# EAGLE schematic EDCPSUMK2 (EAGLE 9.6.2)
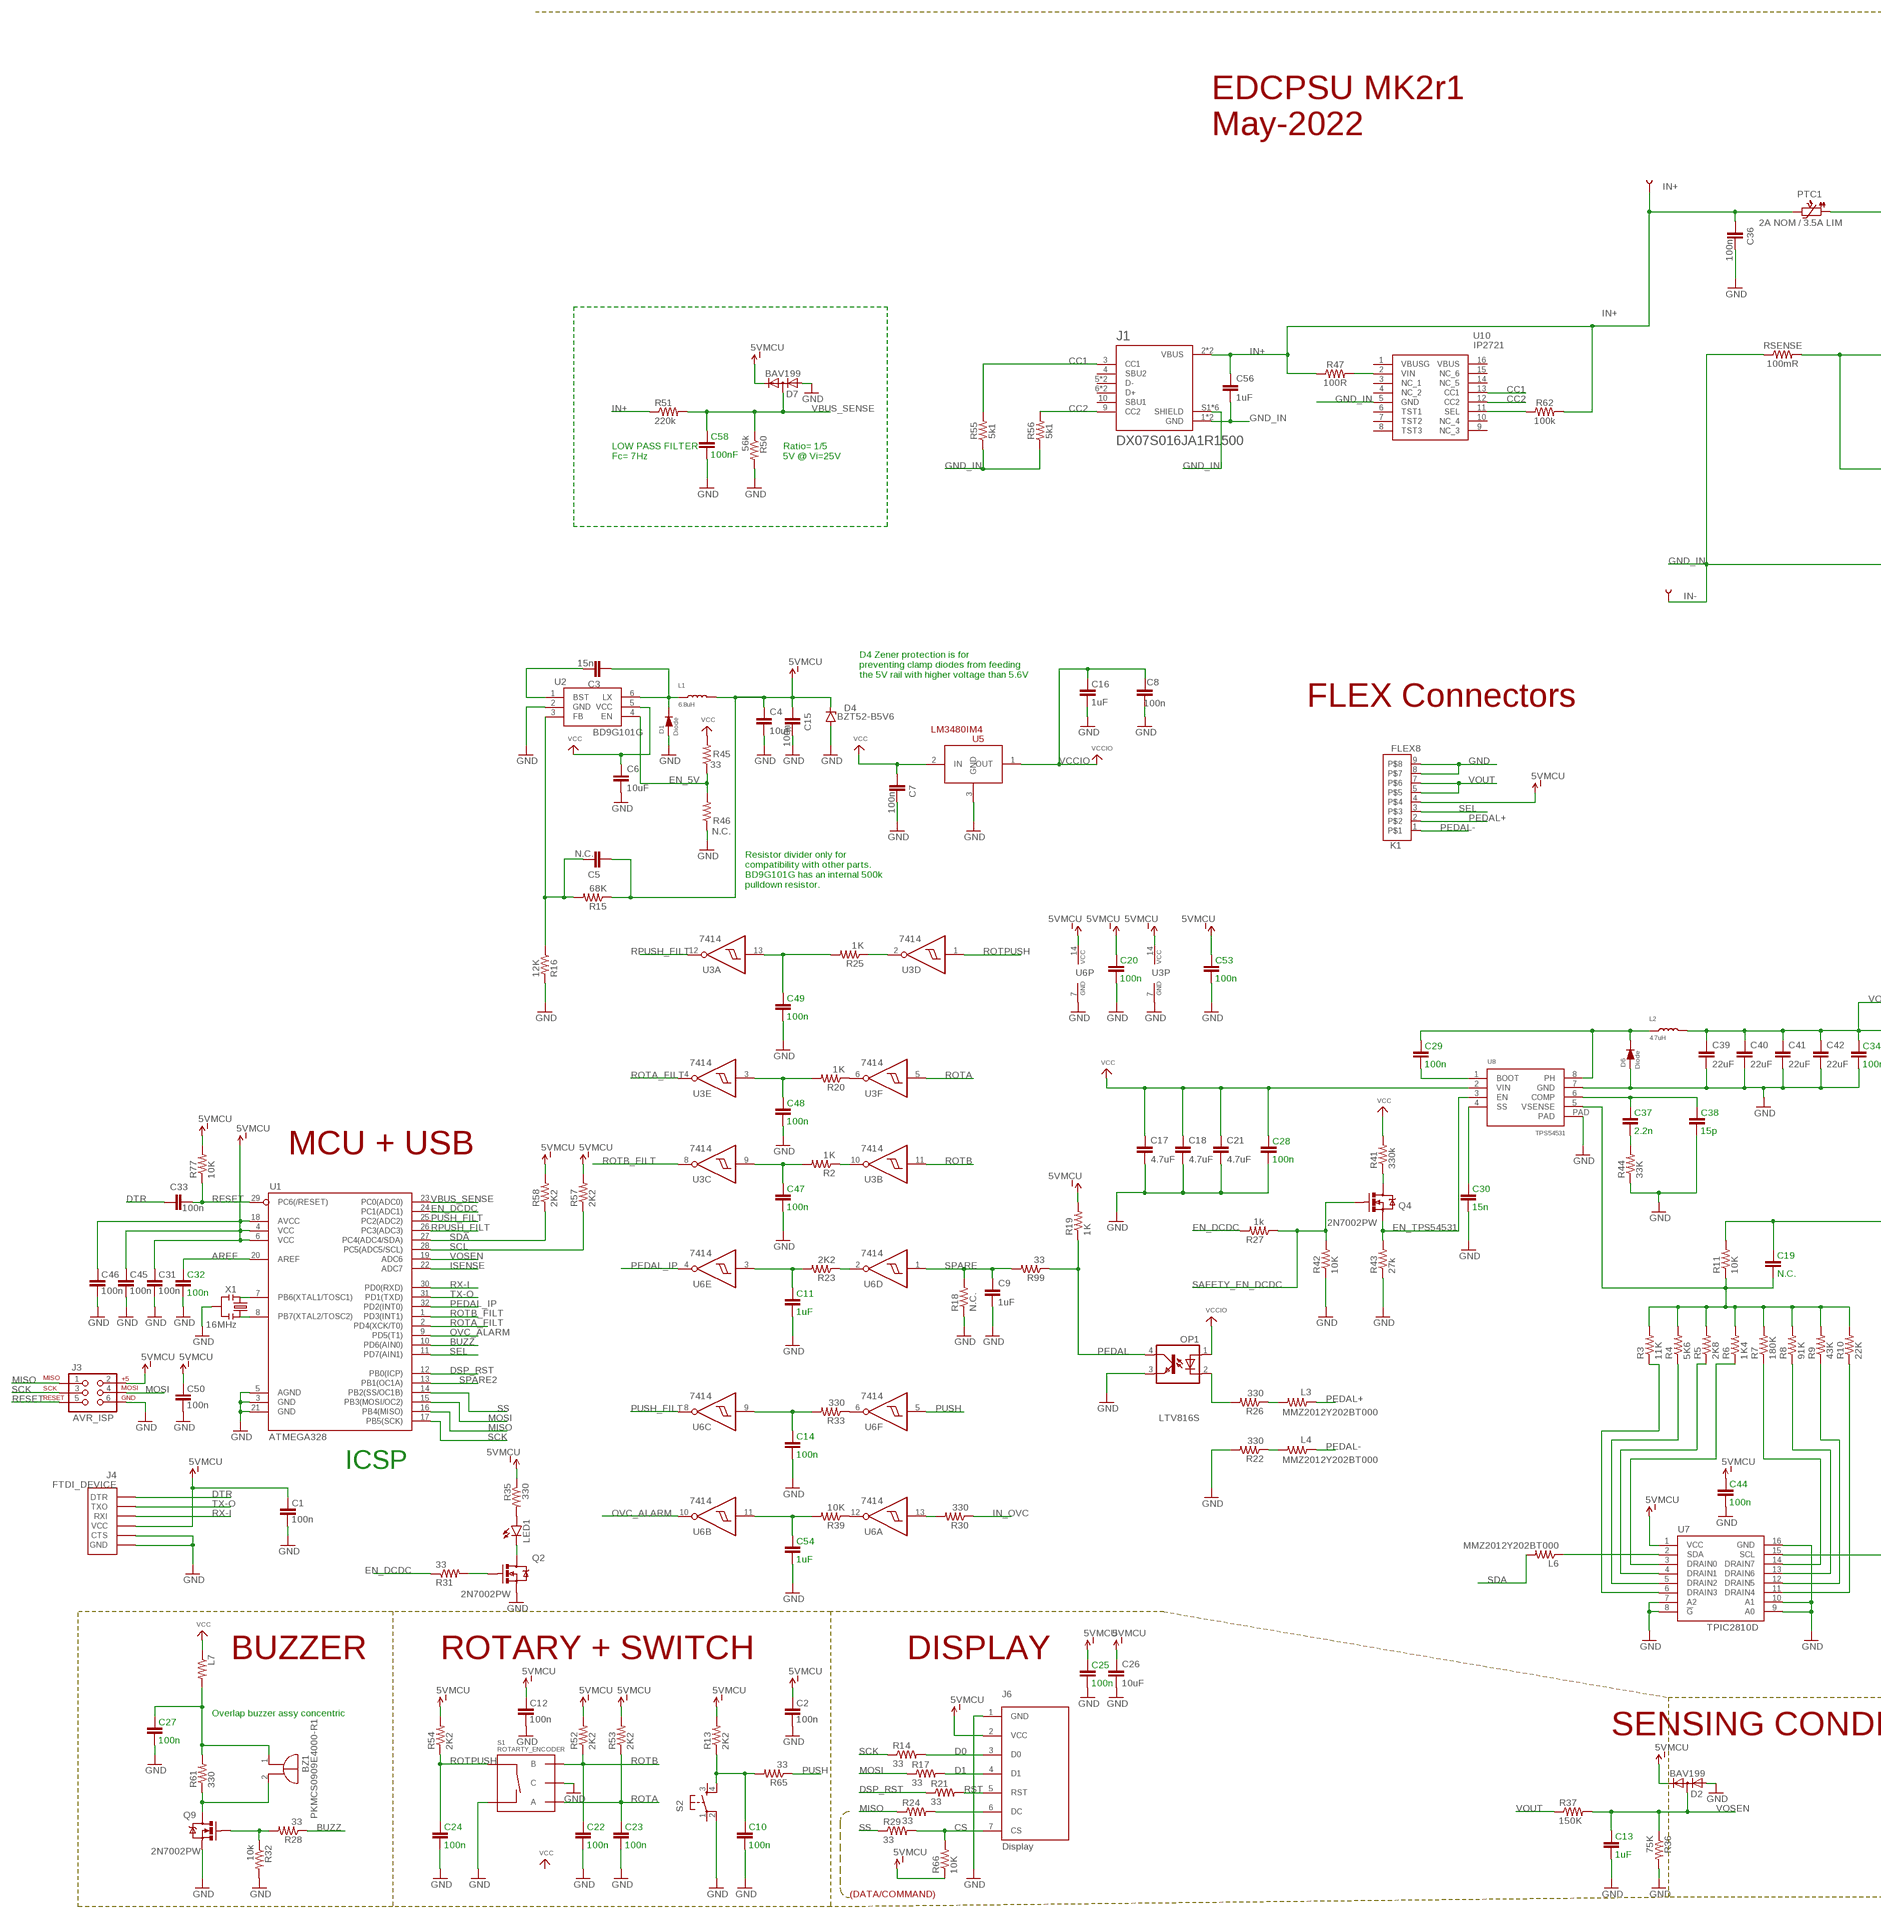
[diagram p0: schematic, sheet 1, part 1 of 2]
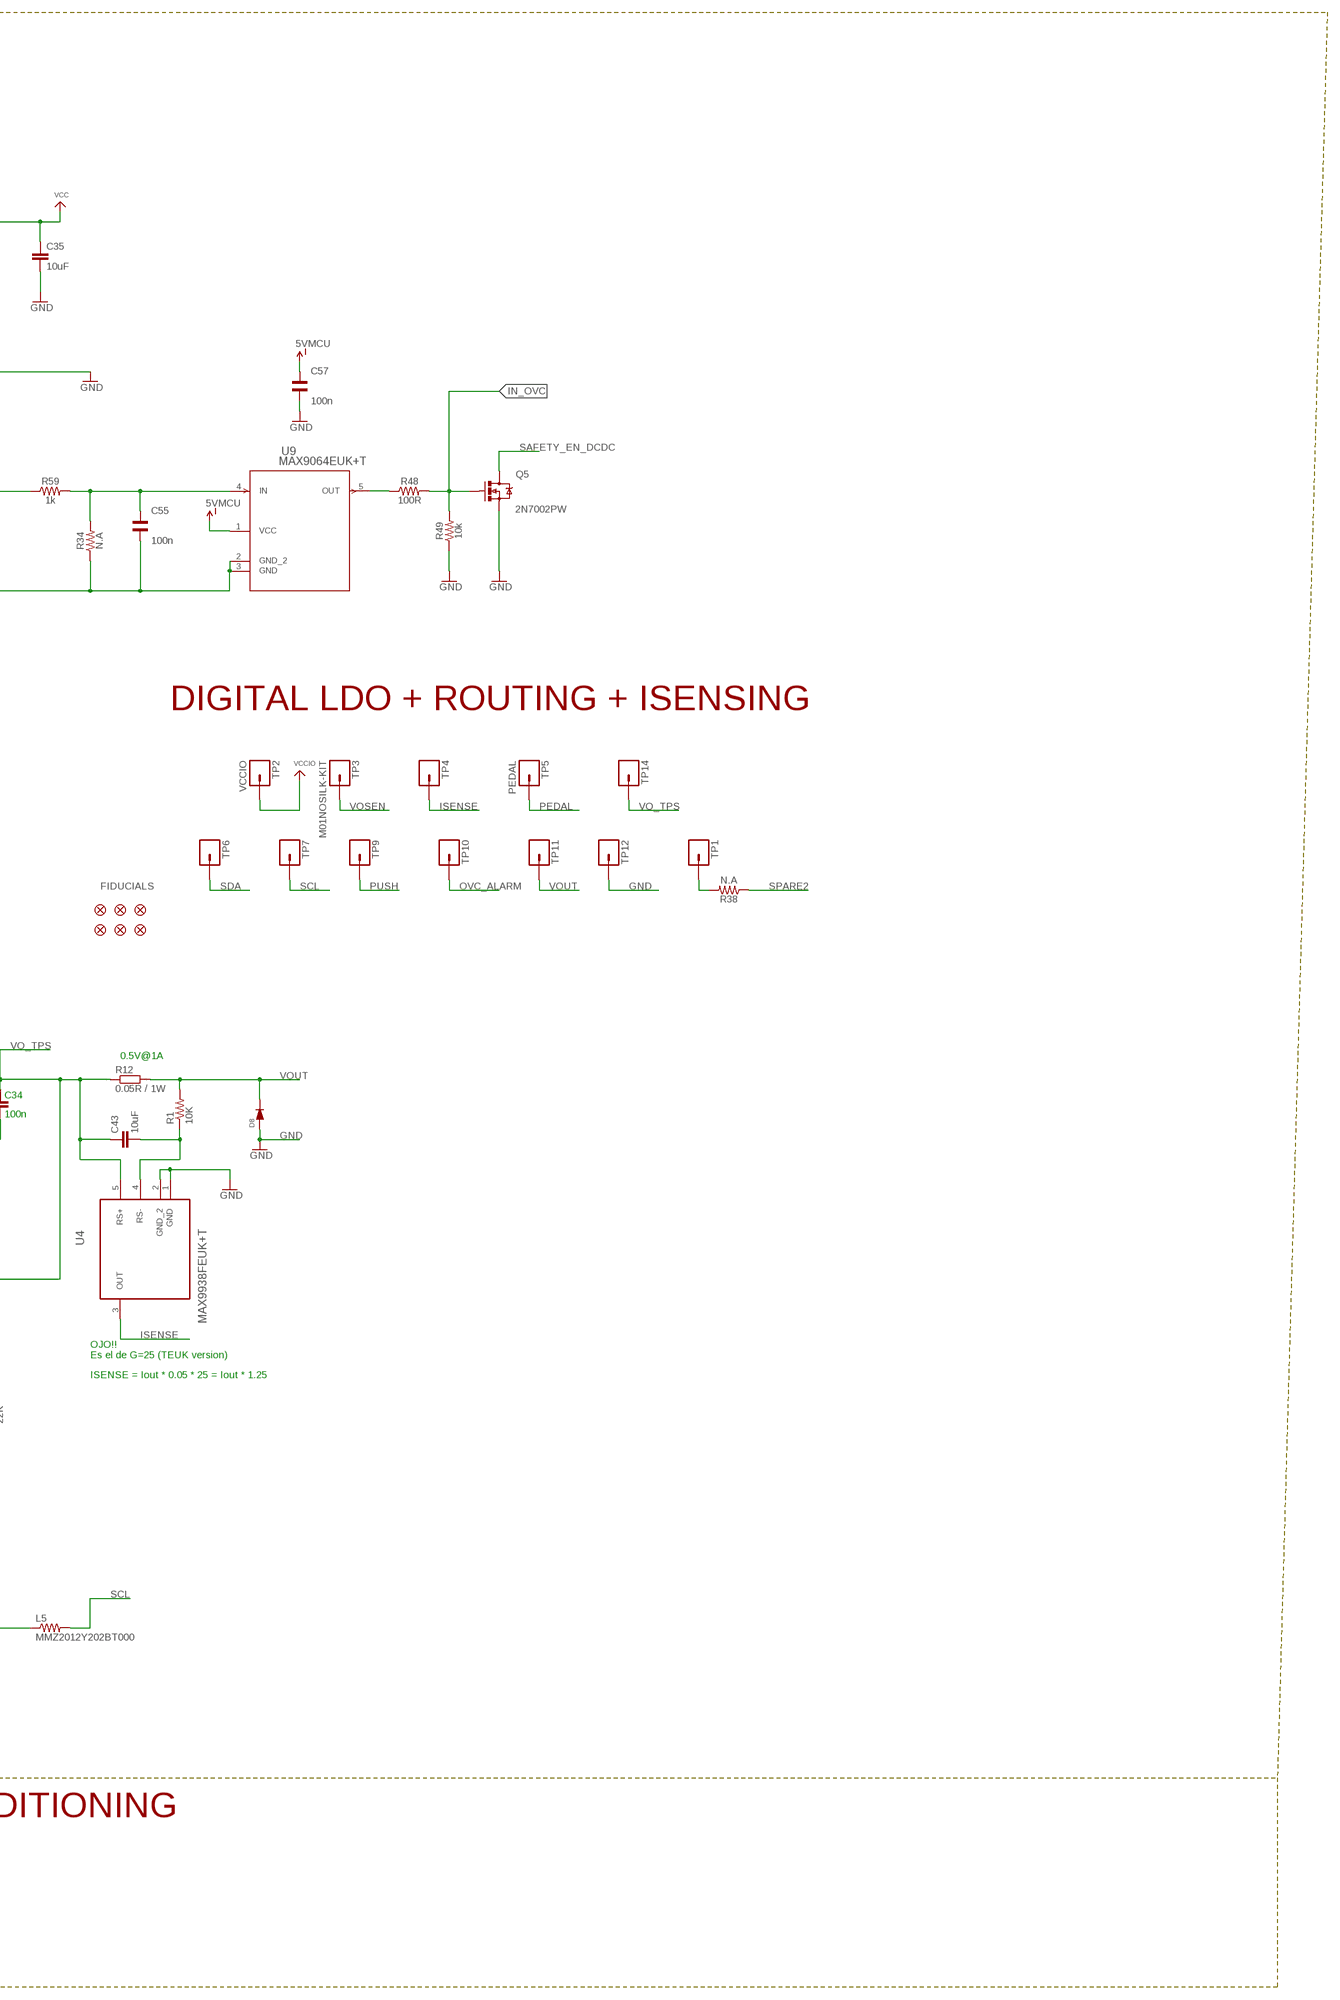
[diagram p1: schematic, sheet 1, part 2 of 2]

## Parts
BZ1  PKMCS0909E4000-R1  [PKMCS0909]
C1  100n  CAP0805  [0805]
C2  100n  CAP0805  [0805]
C3  15n  CAP0805  [0805]
C4  10uF  CAP1206  [1206]
C5  N.C.  CAP0805  [0805]
C6  10uF  CAP1206  [1206]
C7  100n  CAP0805  [0805]
C8  100n  CAP0805  [0805]
C9  1uF  CAP1206  [1206]
C10  100n  CAP0805  [0805]
C11  1uF  CAP0805  [0805]
C12  100n  CAP0805  [0805]
C13  1uF  CAP0805  [0805]
C14  100n  CAP0805  [0805]
C15  100n  CAP0805  [0805]
C16  1uF  CAP0805  [0805]
C17  4.7uF  CAP1210  [1210]
C18  4.7uF  CAP1210  [1210]
C19  N.C.  CAP0805  [0805]
C20  100n  CAP0805  [0805]
C21  4.7uF  CAP1210  [1210]
C22  100n  CAP0805  [0805]
C23  100n  CAP0805  [0805]
C24  100n  CAP0805  [0805]
C25  100n  CAP0805  [0805]
C26  10uF  CAP1206  [1206]
C27  100n  CAP0805  [0805]
C28  100n  CAP0805  [0805]
C29  100n  CAP0805  [0805]
C30  15n  CAP0805  [0805]
C31  100n  CAP0805  [0805]
C32  100n  CAP0805  [0805]
C33  100n  CAP0805  [0805]
C34  100n  CAP0805  [0805]
C35  10uF  CAP1206  [1206]
C36  100n  CAP0805  [0805]
C37  2.2n  CAP0805  [0805]
C38  15p  CAP0805  [0805]
C39  22uF  CAP1210  [1210]
C40  22uF  CAP1210  [1210]
C41  22uF  CAP1210  [1210]
C42  22uF  CAP1210  [1210]
C43  10uF  CAP1206  [1206]
C44  100n  CAP0805  [0805]
C45  100n  CAP0805  [0805]
C46  100n  CAP0805  [0805]
C47  100n  CAP0805  [0805]
C48  100n  CAP0805  [0805]
C49  100n  CAP0805  [0805]
C50  100n  CAP0805  [0805]
C53  100n  CAP0805  [0805]
C54  1uF  CAP0805  [0805]
C55  100n  WCAP-CSGP_1206_885012008001  [WCAP-CSGP_1206]
C56  1uF  CAP1206  [1206]
C57  100n  WCAP-CSGP_1206_885012008001  [WCAP-CSGP_1206]
C58  100nF  CAP0805  [0805]
D1  Diode  DSOD123  [SOD123]
D2  BAV199  [SOT23]
D4  BZT52-B5V6  ZENER_DO-219-AB(SOD123F)  [SODFL3718X115]
D6  Diode  DSMC  [DO-214AB]
D7  BAV199  [SOT23]
D8  RB060M-60TR  DSMA  [SMADIODE]
FID1  FIDUCIAL1X2  [FIDUCIAL-1X2]
FID2  FIDUCIAL1X2  [FIDUCIAL-1X2]
FID3  FIDUCIAL1X2  [FIDUCIAL-1X2]
FID4  FIDUCIAL1X2  [FIDUCIAL-1X2]
FID5  FIDUCIAL1X2  [FIDUCIAL-1X2]
FID6  FIDUCIAL1X2  [FIDUCIAL-1X2]
IN+  TEST-POINT3  [PAD.03X.03]
IN-  TEST-POINT3  [PAD.03X.03]
J1  DX07S016JA1R1500  [JAE_DX07S016JA1R1500]
J3  AVR_ISP  AVR_SPI_PRG_6PTH  [2X3]
J4  FTDI_DEVICE  [FTDI_DEVICE_SIDE]
J6  Display  OLED_LCD  [OLED_LCD]
K1  FLEX8  [FLEX8]
L1  6.8uH  L4018  [NR4018T100M]
L2  4.7uH  L74437368047  [WE-LHMI]
L3  MMZ2012Y202BT000  RESISTOR0805-RES  [0805]
L4  MMZ2012Y202BT000  RESISTOR0805-RES  [0805]
L5  MMZ2012Y202BT000  RESISTOR0805-RES  [0805]
L6  MMZ2012Y202BT000  RESISTOR0805-RES  [0805]
L7  MMZ2012Y202BT000  RESISTOR0805-RES  [0805]
LED1  LED3MM  [LED3MM]
OP1  LTV816S  [SMD4]
PTC1  2A NOM / 3.5A LIM  PTC-  [1812L]
Q2  2N7002PW  MOSFET-NCHANNEL2N7002PW  [SOT323]
Q4  2N7002PW  MOSFET-NCHANNEL2N7002PW  [SOT323]
Q5  2N7002PW  MOSFET-NCHANNEL2N7002PW  [SOT323]
Q9  2N7002PW  MOSFET-NCHANNEL2N7002PW  [SOT323]
R1  10K  RESISTOR0805-RES  [0805]
R2  1K  RESISTOR0805-RES  [0805]
R3  11K  RESISTOR0805-RES  [0805]
R4  5K6  RESISTOR0805-RES  [0805]
R5  2K8  RESISTOR0805-RES  [0805]
R6  1K4  RESISTOR0805-RES  [0805]
R7  180K  RESISTOR0805-RES  [0805]
R8  91K  RESISTOR0805-RES  [0805]
R9  43K  RESISTOR0805-RES  [0805]
R10  22K  RESISTOR0805-RES  [0805]
R11  10K  RESISTOR0805-RES  [0805]
R12  0.05R / 1W  RR2512  [R2512]
R13  2K2  RESISTOR0805-RES  [0805]
R14  33  RESISTOR0805-RES  [0805]
R15  68K  RESISTOR0805-RES  [0805]
R16  12K  RESISTOR0805-RES  [0805]
R17  33  RESISTOR0805-RES  [0805]
R18  N.C.  RESISTOR0805-RES  [0805]
R19  1K  RESISTOR0805-RES  [0805]
R20  1K  RESISTOR0805-RES  [0805]
R21  33  RESISTOR0805-RES  [0805]
R22  330  RESISTOR1206  [1206]
R23  2K2  RESISTOR0805-RES  [0805]
R24  33  RESISTOR0805-RES  [0805]
R25  1K  RESISTOR0805-RES  [0805]
R26  330  RESISTOR1206  [1206]
R27  1k  RESISTOR0805-RES  [0805]
R28  33  RESISTOR0805-RES  [0805]
R29  33  RESISTOR0805-RES  [0805]
R30  330  RESISTOR0805-RES  [0805]
R31  33  RESISTOR0805-RES  [0805]
R32  10k  RESISTOR0805-RES  [0805]
R33  330  RESISTOR0805-RES  [0805]
R34  N.A  RESISTOR0603  [0603]
R35  330  RESISTOR0805-RES  [0805]
R36  75K  RESISTOR0805-RES  [0805]
R37  150K  RESISTOR0805-RES  [0805]
R38  N.A  RESISTOR0603  [0603]
R39  10K  RESISTOR0805-RES  [0805]
R41  330k  RESISTOR0805-RES  [0805]
R42  10K  RESISTOR0805-RES  [0805]
R43  27k  RESISTOR0805-RES  [0805]
R44  33K  RESISTOR0805-RES  [0805]
R45  33  RESISTOR0805-RES  [0805]
R46  N.C.  RESISTOR0805-RES  [0805]
R47  100R  RESISTOR0603  [0603]
R48  100R  RESISTOR0603  [0603]
R49  10k  RESISTOR0603  [0603]
R50  56k  RESISTOR0603  [0603]
R51  220k  RESISTOR0603  [0603]
R52  2K2  RESISTOR0805-RES  [0805]
R53  2K2  RESISTOR0805-RES  [0805]
R54  2K2  RESISTOR0805-RES  [0805]
R55  5k1  RESISTOR0603  [0603]
R56  5k1  RESISTOR0603  [0603]
R57  2K2  RESISTOR0805-RES  [0805]
R58  2K2  RESISTOR0805-RES  [0805]
R59  1k  RESISTOR0603  [0603]
R61  330  RESISTOR0805-RES  [0805]
R62  100k  RESISTOR0603  [0603]
R65  33  RESISTOR0805-RES  [0805]
R66  10K  RESISTOR0805-RES  [0805]
R77  10K  RESISTOR0805-RES  [0805]
R99  33  RESISTOR0805-RES  [0805]
RSENSE  100mR  RESISTOR1206  [1206]
S1  ROTARTY_ENCODER  [ROTARY_ENC_PLAIN]
S2  TAC_SWITCH_KSC931G-SMD  [TAC_SW_SMD_KSC931G]
TP1  M01POGOPIN_HOLE_LARGE  [1X01_POGOPIN_HOLE_LARGE]
TP2  VCCIO  M01POGOPIN_HOLE_LARGE  [1X01_POGOPIN_HOLE_LARGE]
TP3  M01NOSILK-KIT  [1X01NS-KIT]
TP4  M01POGOPIN_HOLE_LARGE  [1X01_POGOPIN_HOLE_LARGE]
TP5  PEDAL  M01POGOPIN_HOLE_LARGE  [1X01_POGOPIN_HOLE_LARGE]
TP6  M01POGOPIN_HOLE_LARGE  [1X01_POGOPIN_HOLE_LARGE]
TP7  M01POGOPIN_HOLE_LARGE  [1X01_POGOPIN_HOLE_LARGE]
TP9  M01POGOPIN_HOLE_LARGE  [1X01_POGOPIN_HOLE_LARGE]
TP10  M01POGOPIN_HOLE_LARGE  [1X01_POGOPIN_HOLE_LARGE]
TP11  M01POGOPIN_HOLE_LARGE  [1X01_POGOPIN_HOLE_LARGE]
TP12  M01POGOPIN_HOLE_LARGE  [1X01_POGOPIN_HOLE_LARGE]
TP14  M01POGOPIN_HOLE_LARGE  [1X01_POGOPIN_HOLE_LARGE]
U1  ATMEGA328  ATMEGA168  [TQFP32-08]
U2  BD9G101G  [SSOP6]
U3  7414  [TSSOP14]
U4  MAX9938FEUK+T  [SOT95P280X145-5N]
U5  LM3480IM4  [SOT23-3]
U6  7414  [TSSOP14]
U7  TPIC2810D  [SO16]
U8  TPS54531  TPS5431DDAR  [SOIC8]
U9  MAX9064EUK+T  [21-0057F_MXM]
U10  IP2721  [SOP65P640X120-16N]
X1  16MHz  RESONATORSMD  [RESONATOR-SMD]

## Nets
AREF: C32.2 U1.20(AREF)
BUZZ: R28.1 U1.10(PD6(AIN0))
CC1: J1.3(CC1) R55.2 U10.13(CC1)
CC2: J1.9(CC2) R56.2 U10.12(CC2)
CS: J6.7(CS) R29.2 R66.2
D0: J6.3(D0) R14.2
D1: J6.4(D1) R17.2
DSP_RST: R21.1 U1.12(PB0(ICP))
DTR: C33.2 J4.P$1(DTR)
EN_5V: R45.1 R46.2 U2.4(EN)
EN_DCDC: R27.2 R31.1 U1.24(PC1(ADC1))
EN_TPS54531: Q4.2(S) R43.2 U8.3(EN)
GND: C1.1 C2.1 C4.2 C6.2 C7.1 C8.1 C9.2 C10.1 C11.1 C12.1 C13.1 C14.1 C15.1 C16.1 C17.2 C18.2 C20.1 C21.2 C22.1 C23.1 C24.1 C25.1 C26.2 C27.1 C28.1 C30.1 C31.1 C32.1 C34.1 C35.2 C36.1 C38.1 C39.2 C40.2 C41.2 C42.2 C44.1 C45.1 C46.1 C47.1 C48.1 C49.1 C50.1 C53.1 C54.1 C57.1 C58.1 D1.+(A) D2.1(A) D4.1(A) D6.1(A) D7.1(A) D8.A J3.6 J4.P$5(CTS) J4.P$6(GND) J6.1(GND) K1.8 K1.9 OP1.3(EMIT) Q2.2(S) Q5.2(S) Q9.2(S) R16.2 R18.1 R22.2 R32.2 R36.2 R42.1 R43.1 R44.1 R46.1 R49.1 R50.2 R59.1 RSENSE.2 S1.C S1.SW- S2.2 TP12.1 U1.3(GND) U1.5(AGND) U1.21(GND) U2.2(GND) U3.7(P:GND) U4.1(GND) U4.2(GND_2) U5.3(GND) U6.7(P:GND) U7.7(A2) U7.8(!G) U7.9(A0) U7.10(A1) U7.16(GND) U8.7(GND) U8.PAD X1.2
GND_IN: C55.1 C56.2 IN-.P$1 J1.1(GND) J1.12(GND) J1.S1(SHIELD) J1.S2(SHIELD) J1.S3(SHIELD) J1.S4(SHIELD) J1.S5(SHIELD) J1.S6(SHIELD) R34.1 R55.1 R56.1 RSENSE.1 U9.2(GND_2) U9.3(GND) U10.5(GND)
IN+: C36.2 C56.1 IN+.P$1 J1.2(VBUS) J1.11(VBUS) PTC1.2 R47.1 R51.1 R62.2
IN_OVC: Q5.1(G) R30.1 R48.2 R49.2
ISENSE: TP4.1 U1.22(ADC7) U4.3(OUT)
MISO: J3.1 R24.1 U1.16(PB4(MISO))
MOSI: J3.4 R17.1 U1.15(PB3(MOSI/OC2))
N$1: R3.1 U7.6(DRAIN3)
N$2: R4.1 U7.5(DRAIN2)
N$3: R5.1 U7.4(DRAIN1)
N$4: R6.1 U7.3(DRAIN0)
N$5: R7.1 U7.14(DRAIN7)
N$6: J6.6(DC) R24.2
N$7: R8.1 U7.13(DRAIN6)
N$8: R9.1 U7.12(DRAIN5)
N$9: R10.1 U7.11(DRAIN4)
N$10: C43.2 R1.1 U4.4(RS-)
N$11: LED1.A R35.2
N$12: LED1.K(C) Q2.3(D)
N$13: R33.1 U6.6(F:O)
N$14: R30.2 U6.13(A:I)
N$15: R39.1 U6.12(A:O)
N$16: C3.1 U2.1(BST)
N$17: C10.2 R13.1 R65.2 S2.4
N$18: C47.2 R2.2 U3.9(C:I)
N$19: C3.2 D1.-(K) L1.1 U2.6(LX)
N$20: Q9.1(G) R28.2 R32.1
N$21: Q2.1(G) R31.2
N$22: R2.1 U3.10(B:O)
N$23: R20.1 U3.6(F:O)
N$24: U1.8(PB7(XTAL2/TOSC2)) X1.1
N$25: R25.1 U3.2(D:O)
N$26: C49.2 R25.2 U3.13(A:I)
N$27: C5.1 R15.2 R16.1 U2.3(FB)
N$28: C48.2 R20.2 U3.3(E:I)
N$29: C11.2 R23.2 U6.3(E:I)
N$32: BZ1.1(+) C27.2 L7.2 R61.2
N$34: R23.1 U6.2(D:O)
N$35: Q4.3(D) R41.1
N$36: U1.7(PB6(XTAL1/TOSC1)) X1.3
N$37: C14.2 R33.2 U6.9(C:I)
N$38: R38.2 TP1.1
N$39: C54.2 R39.2 U6.11(B:I)
N$40: L6.1 U7.2(SDA)
N$41: OP1.2(C) R26.2
N$43: L3.2 R26.1
N$44: C30.2 U8.4(SS)
N$45: R62.1 U10.11(SEL)
N$46: L4.2 R22.1
N$47: C29.1 U8.1(BOOT)
N$48: C19.1 R3.2 R4.2 R5.2 R6.2 R7.2 R8.2 R9.2 R10.2 R11.1 U8.5(VSENSE)
N$50: R47.2 U10.2(VIN)
N$51: C29.2 D6.2(K) L2.1 U8.8(PH)
N$52: C37.2 C38.2 U8.6(COMP)
N$53: C37.1 R44.2
N$54: L5.1 U7.15(SCL)
N$58: R48.1 U9.5(OUT)
N$59: C55.2 R34.2 R59.2 U9.4(IN)
N$64: BZ1.2(-) Q9.3(D) R61.1
OVC_ALARM: TP10.1 U1.9(PD5(T1)) U6.10(B:O)
PEDAL: OP1.4(COL) R19.1 R99.1 TP5.1
PEDAL+: K1.2 L3.1
PEDAL-: K1.1 L4.1
PEDAL_IP: U1.32(PD2(INT0)) U6.4(E:O)
PUSH: R65.1 TP9.1 U6.5(F:I)
PUSH_FILT: U1.25(PC2(ADC2)) U6.8(C:O)
RESET: C33.1 J3.5 R77.1 U1.29(PC6(/RESET))
ROTA: C23.2 R53.1 S1.A U3.5(F:I)
ROTA_FILT: U1.2(PD4(XCK/T0)) U3.4(E:O)
ROTB: C22.2 R52.1 S1.B U3.11(B:I)
ROTB_FILT: U1.1(PD3(INT1)) U3.8(C:O)
ROTPUSH: C24.2 R54.1 S1.SW+ U3.1(D:I)
RPUSH_FILT: U1.26(PC3(ADC3)) U3.12(A:O)
RST: J6.5(RST) R21.2
RX-I: J4.P$3(RXI) U1.30(PD0(RXD))
SAFETY_EN_DCDC: Q4.1(G) Q5.3(D) R27.1 R42.2
SCK: J3.3 R14.1 U1.17(PB5(SCK))
SCL: L5.2 R57.1 TP7.1 U1.28(PC5(ADC5/SCL))
SDA: L6.2 R58.1 TP6.1 U1.27(PC4(ADC4/SDA))
SEL: K1.3 U1.11(PD7(AIN1))
SPARE: C9.1 R18.2 R99.2 U6.1(D:I)
SPARE2: R38.1 U1.13(PB1(OC1A))
SS: R29.1 U1.14(PB2(SS/OC1B))
TX-O: J4.P$2(TXO) U1.31(PD1(TXD))
VBUS_SENSE: C58.2 D7.3(AC) R50.1 R51.2 U1.23(PC0(ADC0))
VCC: C6.1 C7.2 C17.1 C18.1 C21.1 C28.2 C35.1 L7.1 PTC1.1 R41.2 R45.2 U2.5(VCC) U5.2(IN) U8.2(VIN)
VCC-ISO: C1.2 C2.2 C4.1 C5.2 C12.2 C15.2 C20.2 C25.2 C26.1 C31.2 C44.2 C45.2 C46.2 C50.2 C53.2 C57.2 D2.2(C) D4.2(C) D7.2(C) J3.2 J4.P$4(VCC) J6.2(VCC) K1.4 L1.2 R13.2 R15.1 R19.2 R35.1 R52.2 R53.2 R54.2 R57.2 R58.2 R66.1 R77.2 U1.4(VCC) U1.6(VCC) U1.18(AVCC) U3.14(P:VCC) U6.14(P:VCC) U7.1(VCC) U9.1(VCC) ; supply symbol labelled 5VMCU
VCCIO: C8.2 C16.2 OP1.1(A) TP2.1 U5.1(OUT)
VO_TPS: C19.2 C34.2 C39.1 C40.1 C41.1 C42.1 C43.1 L2.2 R11.2 R12.1 TP14.1 U4.5(RS+)
VOSEN: C13.2 D2.3(AC) R36.1 R37.2 TP3.1 U1.19(ADC6)
VOUT: D8.C(K) K1.5 K1.7 R1.2 R12.2 R37.1 TP11.1
Unconnected: J1.4(SBU2) J1.5(D-) J1.6(D+) J1.7(D+) J1.8(D-) J1.10(SBU1) S2.1 S2.3 U10.1(VBUSG) U10.3(NC_1) U10.4(NC_2) U10.6(TST1) U10.7(TST2) U10.8(TST3) U10.9(NC_3) U10.10(NC_4) U10.14(NC_5) U10.15(NC_6) U10.16(VBUS)

## Notes on the sheet
- EDCPSU MK2r1
  May-2022
- LOW PASS FILTER
  Fc= 7Hz
- Ratio= 1/5
  5V @ Vi=25V
- DIGITAL LDO + ROUTING + ISENSING
- D4 Zener protection is for
  preventing clamp diodes from feeding
  the 5V rail with higher voltage than 5.6V
- FLEX Connectors
- FIDUCIALS
- Resistor divider only for
  compatibility with other parts.
  BD9G101G has an internal 500k
  pulldown resistor.
- 0.5V@1A
- MCU + USB
- OJO!!
  Es el de G=25 (TEUK version)
- ISENSE = Iout * 0.05 * 25 = Iout * 1.25
- ICSP
- BUZZER | ROTARY + SWITCH | DISPLAY
- Overlap buzzer assy concentric
- SENSING CONDITIONING
- (DATA/COMMAND)

## Library data of the parts
BZ1 = buzzer:PKMCS0909E4000-R1: PKMCS0909E4000-R1 Source : http://www.murata.com/~/media/webrenewal/products/sound/sounder/vppt-buzj083-d.ashx
C1-C3 C5 C7 C8 C10-C16 C19 C20 C22-C25 C27-C34 C36-C38 C44-C50 C53 C54 C58 = SparkFun:CAP: Capacitor Standard 0603 ceramic capacitor, and 0.1" leaded capacitor.
C4 C6 C9 C17 C18 C21 C26 C35 C39-C43 C56 = SparkFun-Passives:CAP: Capacitor Standard 0603 ceramic capacitor, and 0.1" leaded capacitor.
C55 C57 = Wurth_Elektronik_Passive_Capacitors_rev19a:WCAP-CSGP_1206: WCAP-CSGP Ceramic Capacitors Characteristics Multilayer Ceramic Chip Capacitor Recommended soldering:Reflow, for 0603 and 0805 wave soldering is also allowed Operating temperature:-55 °C to +125 °C; Ceramic characteristics: Class I - NPO ; Class II -X7R, X5R High performance ceramic High capacitance stability Minimal aging Termination:Cu/Ni/Sn <http://katalog.we-online.de/media/images/eisos/WCAP-CSGP_pf2.jpg> Details see: http://katalog.we-online.de/en/pbs/WCAP-CSGP-1206? Created: 2015-01-28 2015 (C) Wurth Elektronik
D1 D6 D8 = EDCPSU - Rev3:D*
D2 D7 = diode:BAV199: DIODE low-leakage double diode
D4 = Diode:ZENER: Zener Diode - Generic; CATEGORY: Diode; SUB-CATEGORY: Zener
FID1-FID6 = SparkFun-Aesthetics:FIDUCIAL: Fiducial Alignment Points Various fiducial points for machine vision alignment.
IN+ IN- = SparkFun-Connectors:TEST-POINT: SparkFun Test Points Bare copper test points for troubleshooting or In-Circuit-Testing. These are used by our Production team for verifying production board runs using pogo-pins on test beds. SparkFun Products: SparkFun LSM9DS1 Breakout <https://www.sparkfun.com/products/13284> SparkFun PSOC <https://www.sparkfun.com/products/13714> SparkFun Load Cell Amplifier <https://www.sparkfun.com/products/13879>
J1 = DX07S016JA1R1500:DX07S016JA1R1500: USB-C (USB TYPE-C) USB 2.0 Receptacle Connector 24 (16+8 Dummy) Position Surface Mount, Right Angle; Through Hole; DESCRIPTION: USB-C (USB TYPE-C) USB 2.0 Receptacle Connector 24 (16+8 Dummy) Position Surface Mount, Right Angle; Through Hole; DIGI-KEY_PART_NUMBER: 670-DX07S016JA1R1500CT-ND; MF: JAE Electronics; MP: DX07S016JA1R1500; PACKAGE: None; PURCHASE-URL: https://pricing.snapeda.com/search/part/DX07S016JA1R1500/?ref=eda
J3 = SparkFun-Connectors:AVR_SPI_PRG_6: AVR ISP 6 Pin This is the reduced ISP connector for AVR programming. Common on Arduino. This footprint will take up less PCB space and can be used with a 10-pin to 6-pin adapter such as SKU: BOB-08508 **Special note about "TEST_POINT" package. The stop mask is on the top side, so if you want your programming test points to be on the bottom of your board, make sure to place this package on the bottom side of the board. This also ensure that the orientation to program from the bottom side will be correct.
J4 = SparkFun-Connectors:FTDI_DEVICE: Connector which mates to FTDI basic or FTDI cable.
J6 = EDCPSU:OLED_LCD
K1 = Flex_3mm:FLEX8: WR-FPC 1mm SMT Horiz. Bot. Contact Hinge type WR-FPC 1mm 08 pins Hinge type SMT Horizontal Bottom Contact ;=>Code : Con_FPC_ZIF_1.00_6861xx148922_686108148922 <http://katalog.we-online.de/media/images/eican/Con_FPC_ZIF_1.00_686110148922_pf2.jpg> Details see: http://katalog.we-online.de/em/datasheet/6861xx148922.pdf Created 2014-10-08, Karrer Zheng 2014 (C) Wurth Elektronik
L1 L2 = EDCPSU - Rev3:L*
L3-L7 R1-R11 R13-R21 R23-R25 R27-R33 R35-R37 R39 R41-R46 R52-R54 R57 R58 R61 R65 R66 R77 R99 = SparkFun:RESISTOR: Resistor Basic schematic elements and footprints for 0603, 1206, and PTH resistors.
LED1 = SparkFun-LED:LED: LEDs Standard schematic elements and footprints for 5mm, 3mm, 1206, and 0603 sized LEDs. 5mm - Spark Fun Electronics SKU : COM-00529 (and others)
OP1 = optocoupler:LTV816: OPTO COUPLER Source: LITEON, LTV816.pdf; OC_FARNELL: unknown; OC_NEWARK: unknown
PTC1 = EDCPSU:PTC-: Positive Temperature Coefficient Resistor (PTC) PTC Littlefuse 1812L200THPR - Resetteable Fuse 3.5A.pdf
Q2 Q4 Q5 Q9 = SparkFun-DiscreteSemi:MOSFET-NCHANNEL: Common NMOSFET Parts MFG P/N Store ID Prod ID FDD8780 TRANS-09984 SI7820DN TRANS-11055 FDS6630A IC-08089 2N7002PW TRANS-11151 FQP30N06L COM-10213 TRANS-10060 BSS123LT1G TRANS-08345 BSS138 TRANS-00830 BS170 2N7000; PROD_ID: TRANS-11151
R12 = eagle-ltspice:R: RESISTOR, European symbol; SPICEMODEL: NONE; SPICEPREFIX: R
R22 R26 = SparkFun-Passives:RESISTOR: Resistor Basic schematic elements and footprints for 0603, 1206, and PTH resistors.
R34 R38 R47-R51 R55 R56 R59 R62 RSENSE = SparkFun-Resistors:RESISTOR: Generic Resistor Package
S1 = SparkFun-Electromechanical:ROTARTY_ENCODER: Simple no LED rotary encoder Example: COM-09117
S2 = EDCPSU - Rev2:TAC_SWITCH: Momentary Switch Button commonly used for reset or general input. Spark Fun Electronics SKU : COM-00097 SMT- SWCH-08247
TP1-TP7 TP9-TP12 TP14 = SparkFun-Connectors:M01: Header 1 Standard 1-pin 0.1" header. Use with straight break away headers (SKU : PRT-00116), right angle break away headers (PRT-00553), swiss pins (PRT-00743), machine pins (PRT-00117), and female headers (PRT-00115).
U1 = SparkFun:ATMEGA168
U2 = EDCPSU - Rev3:BD9G101G: BD9G101G - Simple Step-down Switching Regulators with Built-in Power MOSFET
U3 U6 = 74xx-eu:74*14: Hex schmitt trigger INVERTER
U4 = MAX9938:MAX9938FEUK+T; DESCRIPTION: Precision Current-Sense Amplifier; MPN: MAX9938FEUK+T; OC_FARNELL: -; OC_NEWARK: 01N6733; PACKAGE: SOT-23-5; SUPPLIER: Maxim
U5 = SparkFun-PowerIC:LM3480IM4: Small package linear regulator
U7 = EDCPSU - Rev2:TPIC2810D
U8 = EDCPSU - Rev3:TPS5431DDAR: Source : http://www.ti.com/lit/ds/symlink/tps54531.pdf
U9 = MAX9064:MAX9064EUK+T; COPYRIGHT: Copyright (C) 2022 Ultra Librarian. All rights reserved.; DIGI-KEY_PART_NUMBER_1: MAX9064EUK+TCT-ND; DIGI-KEY_PART_NUMBER_2: MAX9064EUK+TDKR-ND; DIGI-KEY_PART_NUMBER_3: MAX9064EUK+TTR-ND; MANUFACTURER_PART_NUMBER: MAX9064EUK+T; MFR_NAME: Maxim Integrated Products
U10 = IP2721:IP2721: TYPEC/PD2.0/PD3.0 Physical Layer IC for USB TYPEC input Interfaces Working voltage: 3V~25V Package: TSSOP16 Source: Datasheet <https://datasheet.lcsc.com/szlcsc/2006111335_INJOINIC-IP2721_C603176.pdf>; DESCRIPTION: TYPEC/PD2.0/PD3.0 Physical Layer IC for USB TYPEC input Interfaces Working voltage: 3V~25V Package: TSSOP16; HEIGHT: 1.2mm; MANUFACTURER_NAME: INJOINIC; MANUFACTURER_PART_NUMBER: IP2721
X1 = SparkFun:RESONATOR: Resonator Small SMD resonator. This is the itty bitty 10/20MHz resonators with built in caps. CSTCE10M0G55 and CSTCE20M0V53. Footprint has been reviewed closely but hasn't been tested yet.

## Net classes
1 vcc: width 0.254 mm